# EAGLE design Intercom (EAGLE 7.5.0)

## Sheet 1 of 2
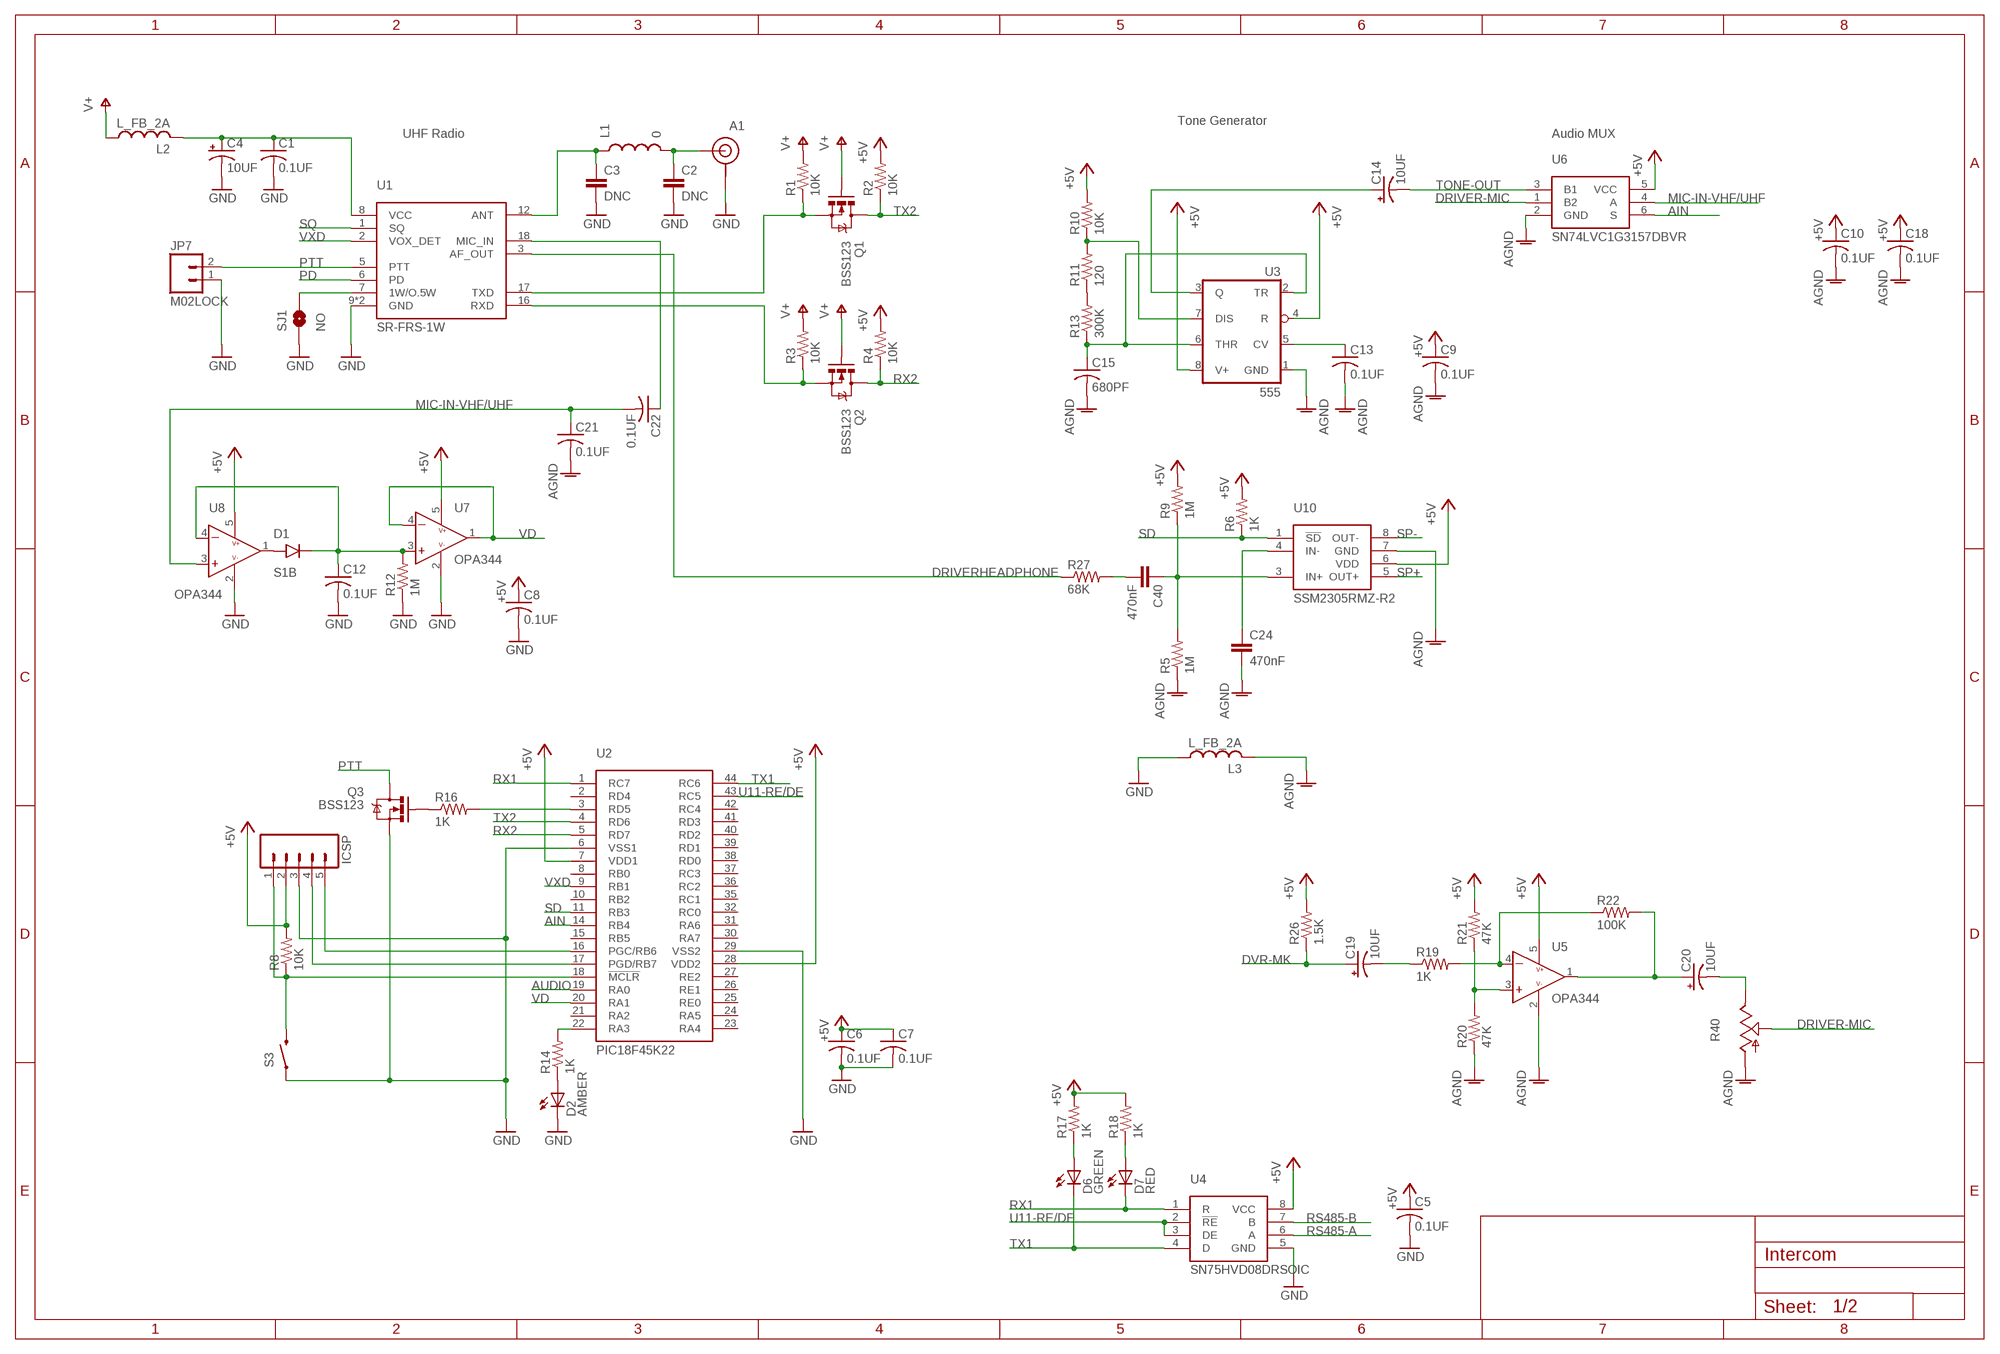
[diagram p0: schematic, sheet 1]

### Parts
A1  CONSMA003.062  [CONSMA003.062]
C1  0.1UF  CAP_0.1UF_50V_0805  [0805]
C2  DNC  CAP0805  [0805]
C3  DNC  CAP0805  [0805]
C4  10UF  CAP-POL_10UF_16V  [EIA3216-16V]
C5  0.1UF  CAP_0.1UF_50V_0805  [0805]
C6  0.1UF  CAP_0.1UF_50V_0805  [0805]
C7  0.1UF  CAP_0.1UF_50V_0805  [0805]
C8  0.1UF  CAP_0.1UF_50V_0805  [0805]
C9  0.1UF  CAP_0.1UF_50V_0805  [0805]
C10  0.1UF  CAP_0.1UF_50V_0805  [0805]
C12  0.1UF  CAP_0.1UF_50V_0805  [0805]
C13  0.1UF  CAP_0.1UF_50V_0805  [0805]
C14  10UF  CAP-POL_10UF_16V  [EIA3216-16V]
C15  680PF  CAP_680PF_50V  [0805]
C18  0.1UF  CAP_0.1UF_50V_0805  [0805]
C19  10UF  CAP-POL_10UF_16V  [EIA3216-16V]
C20  10UF  CAP-POL_10UF_16V  [EIA3216-16V]
C21  0.1UF  CAP_0.1UF_50V_0805  [0805]
C22  0.1UF  CAP_0.1UF_50V_0805  [0805]
C24  470nF  CAP0805  [0805]
C40  470nF  CAP0805  [0805]
D1  S1B  DIODE_S1B  [SMA]
D2  AMBER  LED_AMBER  [CHIP_LED0805]
D6  GREEN  LED_GREEN  [CHIP_LED0805]
D7  RED  LED_RED  [CHIP_LED0805]
ICSP  M05LOCK_LONGPADS  [1X05_LOCK_LONGPADS]
JP7  M02LOCK  [1X02_LOCK]
L1  0  INDUCTOR1007  [1007]
L2  L_FB_2A  [0805]
L3  L_FB_2A  [0805]
Q1  BSS123  MOS-N_BSS123  [SOT23]
Q2  BSS123  MOS-N_BSS123  [SOT23]
Q3  BSS123  MOS-N_BSS123  [SOT23]
R1  10K  RES_10K_1%_0805  [0805]
R2  10K  RES_10K_1%_0805  [0805]
R3  10K  RES_10K_1%_0805  [0805]
R4  10K  RES_10K_1%_0805  [0805]
R5  1M  RES_1M_1%_0805  [0805]
R6  1K  RES_1K_1%_0805  [0805]
R8  10K  RES_10K_1%_0805  [0805]
R9  1M  RES_1M_1%_0805  [0805]
R10  10K  RES_10K_1%_0805  [0805]
R11  120  RES_120_1%_0805  [0805]
R12  1M  RES_1M_1%_0805  [0805]
R13  300K  RES_300K_1%_0805  [0805]
R14  1K  RES_1K_1%_0805  [0805]
R16  1K  RES_1K_1%_0805  [0805]
R17  1K  RES_1K_1%_0805  [0805]
R18  1K  RES_1K_1%_0805  [0805]
R19  1K  RES_1K_1%_0805  [0805]
R20  47K  RES_47K_1%_0805  [0805]
R21  47K  RES_47K_1%_0805  [0805]
R22  100K  RES_100K_1%_0805  [0805]
R26  1.5K  RES_1.5K_1%_0805  [0805]
R27  68K  RES_68K_1%_0805  [0805]
R40  TRIM_US-CA6H  [CA6H]
S3  SWITCH-MOMENTARY-2SIDE_EZ  [TACTILE-PTH-SIDEEZ]
SJ1  NO  SOLDERJUMPERNO  [SJ_2S-NO]
U1  SR-FRS-1W  [SR-FRS-1W]
U2  PIC18F45K22  [TQFP-44]
U3  555  [SO-8]
U4  SN75HVD08DRSOIC  [SO-8]
U5  OPA344  [SOT23-5]
U6  SN74LVC1G3157DBVR  [SOT23-6]
U7  OPA344  [SOT23-5]
U8  OPA344  [SOT23-5]
U10  SSM2305RMZ-R2  [MSOP-8]

### Nets
+5V: C5.1(+) C6.1(+) C7.1(+) C8.1(+) C9.1(+) C10.1(+) C18.1(+) ICSP.2 R2.2 R4.2 R6.2 R8.2 R9.2 R10.2 R17.2 R18.2 R21.2 R26.2 U2.7(VDD1) U2.28(VDD2) U3.4(R) U3.8(V+) U4.8(VCC) U5.5(V+) U6.5(VCC) U7.5(V+) U8.5(V+) U10.6(VDD) ; also sheet 2
AGND: C9.2(-) C10.2(-) C13.2(-) C15.2(-) C18.2(-) C21.2(-) C24.2 L3.2 R5.1 R20.1 R40.A U3.1(GND) U5.2(V-) U6.2(GND) U10.7(GND) ; also sheet 2
AIN: U2.14(RB4) U6.6(S)
AUDIO: U2.19(RA0)
DRIVER-MIC: R40.S U6.1(B2)
DRIVERHEADPHONE: R27.1 U1.3(AF_OUT)
DVR-MK: C19.A(+) R26.1 ; also sheet 2
GND: A1.G1(GND) A1.G2(GND) A1.G3(GND) A1.G(GND) C1.2(-) C2.2 C3.2 C4.C(-) C5.2(-) C6.2(-) C7.2(-) C8.2(-) C12.2(-) D2.C ICSP.3 JP7.1 L3.1 Q3.2(S) R12.1 S3.1 SJ1.1 U1.9(GND) U1.10(GND) U2.6(VSS1) U2.29(VSS2) U4.5(GND) U7.2(V-) U8.2(V-) ; also sheet 2
MIC-IN-VHF/UHF: C21.1(+) C22.2(-) U6.4(A) U8.3(+)
N$1: C3.1 L1.1 U1.12(ANT)
N$2: A1.S(SIGNAL) C2.1 L1.2
N$3: C1.1(+) C4.A(+) L2.2 U1.8(VCC)
N$4: SJ1.2 U1.7(1W/O.5W)
N$5: D1.A U8.1(O)
N$6: C15.1(+) R13.1 U3.2(TR) U3.6(THR)
N$8: Q2.2(S) R3.1 U1.16(RXD)
N$9: Q1.2(S) R1.1 U1.17(TXD)
N$10: D2.A R14.1
N$11: C13.1(+) U3.5(CV)
N$12: R10.1 R11.2 U3.7(DIS)
N$13: C24.1 U10.4(IN-)
N$14: Q3.1(G) R16.1
N$16: R20.2 R21.1 U5.3(+)
N$17: C14.A(+) U3.3(Q)
N$19: R16.2 U2.3(RD5)
N$20: C20.C(-) R40.E
N$21: C12.1(+) D1.C R12.2 U7.3(+) U8.4(-)
N$23: R11.1 R13.2
N$28: R14.2 U2.22(RA3)
N$33: C20.A(+) R22.2 U5.1(O)
N$37: R19.2 R22.1 U5.4(-)
N$38: C19.C(-) R19.1
N$39: C40.1 R5.2 R9.1 U10.3(IN+)
N$40: ICSP.4 U2.17(PGD/RB7)
N$43: ICSP.5 U2.16(PGC/RB6)
N$45: C40.2 R27.2
N$46: ICSP.1 R8.1 S3.2 U2.18(!MCLR)
N$48: C22.1(+) U1.18(MIC_IN)
N$86: D7.A R18.1
N$87: D6.A R17.1
PD: U1.6(PD)
PTT: JP7.2 Q3.3(D) U1.5(PTT)
RS485-A: U4.6(A) ; also sheet 2
RS485-B: U4.7(B) ; also sheet 2
RX1: D7.C U2.1(RC7) U4.1(R)
RX2: Q2.3(D) R4.1 U2.5(RD7)
SD: R6.1 U2.11(RB3) U10.1(!SD)
SP+: U10.5(OUT+) ; also sheet 2
SP-: U10.8(OUT-) ; also sheet 2
SQ: U1.1(SQ)
TONE-OUT: C14.C(-) U6.3(B1)
TX1: D6.C U2.44(RC6) U4.4(D)
TX2: Q1.3(D) R2.1 U2.4(RD6)
U11-RE/DE: U2.43(RC5) U4.2(!RE) U4.3(DE)
V+: L2.1 Q1.1(G) Q2.1(G) R1.2 R3.2 ; also sheet 2
VD: U2.20(RA1) U7.1(O) U7.4(-)
VXD: U1.2(VOX_DET) U2.9(RB1)
Unconnected: U2.2(RD4) U2.8(RB0) U2.10(RB2) U2.15(RB5) U2.21(RA2) U2.23(RA4) U2.24(RA5) U2.25(RE0) U2.26(RE1) U2.27(RE2) U2.30(RA7) U2.31(RA6) U2.32(RC0) U2.35(RC1) U2.36(RC2) U2.37(RC3) U2.38(RD0) U2.39(RD1) U2.40(RD2) U2.41(RD3) U2.42(RC4)

### Notes on the sheet
- Tone Generator
- UHF Radio | Audio MUX

## Sheet 2 of 2
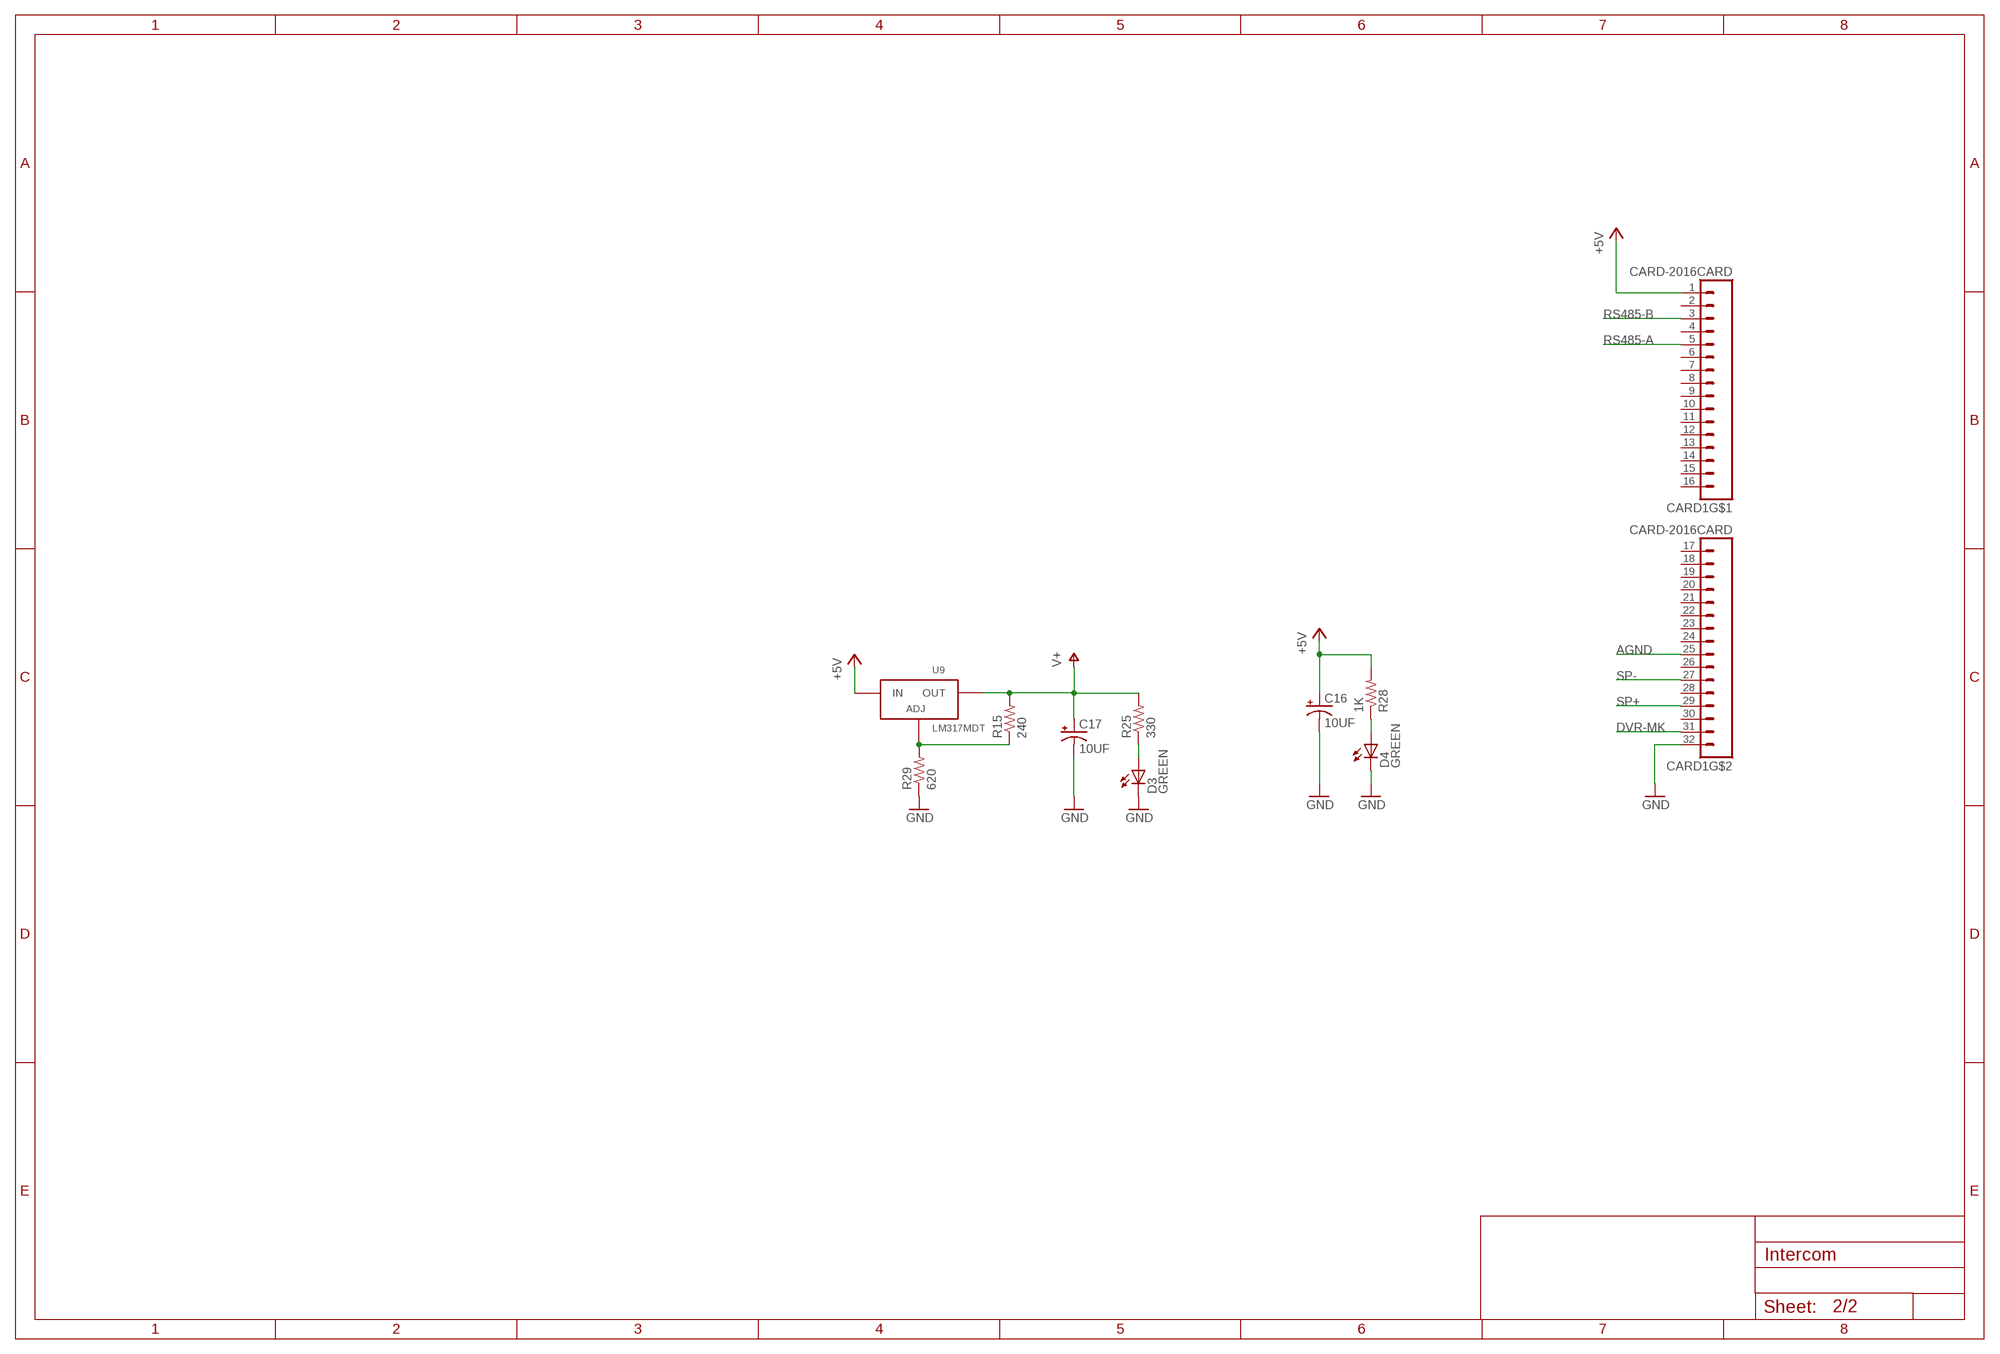
[diagram p1: schematic, sheet 2]

### Parts
C16  10UF  CAP-POL_10UF_16V  [EIA3216-16V]
C17  10UF  CAP-POL_10UF_16V  [EIA3216-16V]
CARD1  CARD-2016CARD  [CARD-2016]
D3  GREEN  LED_GREEN  [CHIP_LED0805]
D4  GREEN  LED_GREEN  [CHIP_LED0805]
R15  240  RES_240_1%_0805  [0805]
R25  330  RES_330_1%_0805  [0805]
R28  1K  RES_1K_1%_0805  [0805]
R29  620  RES_620_1%_0805  [0805]
U9  LM317MDT  [DPAK]

### Nets
+5V: C16.A(+) CARD1.1 R28.2 U9.2(IN) ; also sheet 1
AGND: CARD1.25 ; also sheet 1
DVR-MK: CARD1.31 ; also sheet 1
GND: C16.C(-) C17.C(-) CARD1.32 D3.C D4.C R29.1 ; also sheet 1
N$31: R15.1 R29.2 U9.1(ADJ)
N$54: D4.A R28.1
N$55: D3.A R25.1
RS485-A: CARD1.5 ; also sheet 1
RS485-B: CARD1.3 ; also sheet 1
SP+: CARD1.29 ; also sheet 1
SP-: CARD1.27 ; also sheet 1
V+: C17.A(+) R15.2 R25.2 U9.3(OUT) ; also sheet 1
Unconnected: CARD1.2 CARD1.4 CARD1.6 CARD1.7 CARD1.8 CARD1.9 CARD1.10 CARD1.11 CARD1.12 CARD1.13 CARD1.14 CARD1.15 CARD1.16 CARD1.17 CARD1.18 CARD1.19 CARD1.20 CARD1.21 CARD1.22 CARD1.23 CARD1.24 CARD1.26 CARD1.28 CARD1.30

## Library data of the parts
A1 = FSAE Electric:CONSMA003.062; PARTNO: CONREVSMA003.031
C1 C5-C10 C12 C13 C18 C21 C22 = FSAE Electric:CAP; PARTNO: CC0805ZRY5V9BB104
C2 C3 C24 C40 = SparkFun-Passives:CAP: Capacitor Standard 0603 ceramic capacitor, and 0.1" leaded capacitor.
C4 C14 C16 C17 C19 C20 = FSAE Electric:CAP-POL; PARTNO: T491A106M016AT
C15 = FSAE Electric:CAP; PARTNO: CC0805KRX7R9BB681
CARD1 = FSAE Electric:CARD-2016
D1 = FSAE Electric:DIODE: Diodes; PARTNO: S1B
D2 = FSAE Electric:LED; PARTNO: HSMA-C170
D3 D4 D6 = FSAE Electric:LED; PARTNO: LTST-S220GKT
D7 = FSAE Electric:LED; PARTNO: LH R974-LP-1
ICSP = SparkFun-Connectors:M05: Header 5 Standard 5-pin 0.1" header. Use with straight break away headers (SKU : PRT-00116), right angle break away headers (PRT-00553), swiss pins (PRT-00743), machine pins (PRT-00117), and female headers (PRT-00115). Molex polarized connector foot print use with SKU : PRT-08230 with associated crimp pins and housings.
JP7 = SparkFun-Connectors:M02: Standard 2-pin 0.1" header. Use with - straight break away headers ( PRT-00116) - right angle break away headers (PRT-00553) - swiss pins (PRT-00743) - machine pins (PRT-00117) - female headers (PRT-00115) Molex polarized connector foot print use with: PRT-08233 with associated crimp pins and housings. 2.54_SCREWTERM for use with PRT-10571. 3.5mm Screw Terminal footprints for PRT-08084 5mm Screw Terminal footprints for use with PRT-08433
L1 = SparkFun-Passives:INDUCTOR: Inductors Basic Inductor/Choke - 0603 and 1206. Footprints are not proven and vary greatly between part numbers. SRN6045- 33uH, 20% 1.4A SDR0403-560KL - 56uH, 10%, 500mA RMS/740mA peak
L2 L3 = FSAE Electric:L; PARTNO: FBMH2012HM121-T
Q1-Q3 = FSAE Electric:MOS-N: N-Channel Mosfets; PARTNO: BSS123,215
R1-R4 R8 R10 = FSAE Electric:RES: Resistors; PARTNO: RC0805FR-0710KL
R5 R9 R12 = FSAE Electric:RES: Resistors; PARTNO: RC0805FR-071ML
R6 R14 R16-R19 R28 = FSAE Electric:RES: Resistors; PARTNO: RC0805FR-071KL
R11 = FSAE Electric:RES: Resistors; PARTNO: RC0805FR-07120RL
R13 = FSAE Electric:RES: Resistors; PARTNO: RC0805FR-07300KL
R15 = FSAE Electric:RES: Resistors; PARTNO: RMCF0805FT240R
R20 R21 = FSAE Electric:RES: Resistors; PARTNO: RC0805FR-0747KL
R22 = FSAE Electric:RES: Resistors; PARTNO: RC0805FR-07100KL
R25 = FSAE Electric:RES: Resistors; PARTNO: RC0805FR-07330RL
R26 = FSAE Electric:RES: Resistors; PARTNO: RC0805FR-071K5L
R27 = FSAE Electric:RES: Resistors; PARTNO: RC0805FR-0768KL
R29 = FSAE Electric:RES: Resistors; PARTNO: RC0805FR-07620RL
R40 = pot:TRIM_US-: POTENTIOMETER
S3 = SparkFun-Electromechanical:SWITCH-MOMENTARY-2: Various NO switches- pushbuttons, reed, etc
SJ1 = SparkFun-Passives:SOLDERJUMPER: Solder Jumper Standard SMD solder jumper. Used to automate production. Two varients : Normally Open and Normally Closed are the same, but have different paste layers. NC will have a large amount of paste and should jumper during reflow.
U1 = FSAE Eletric:SR-FRS-1W
U2 = FSAE Electric:PIC18F45K22: Microprocessor used in many places on the car View on DigiKey <http://www.digikey.com/product-detail/en/PIC18F45K22T-I%2FPT/PIC18F45K22T-I%2FPTCT-ND/5169582>; PARTNO: PIC18F45K22T-I/PT
U3 = FSAE Electric:555; PARTNO: NE555PSR
U4 = FSAE Electric:SN75HVD08DR: RS485 Transceiver View on DigiKey <http://www.digikey.com/product-detail/en/SN75HVD08DR/296-37893-1-ND/4899996>; PARTNO: SN75HVD08DR
U5 U7 U8 = FSAE Electric:OPA344; PARTNO: OPA344NA/3K
U6 = FSAE Electric:SN74LVC1G3157DBVR; PARTNO: SN74LVC1G3157DBVR
U9 = FSAE Electric:LM317MDT: IC REG LDO ADJ 0.5A 1.2 V ~ 37 V; PARTNO: LM317MDT-TR
U10 = FSAE Electric:SSM2305RMZ-R2: IC AMP AUDIO 2.8W MONO D

## Net classes
1 VCC: width 0.254 mm, clearance 0.254 mm

## Board
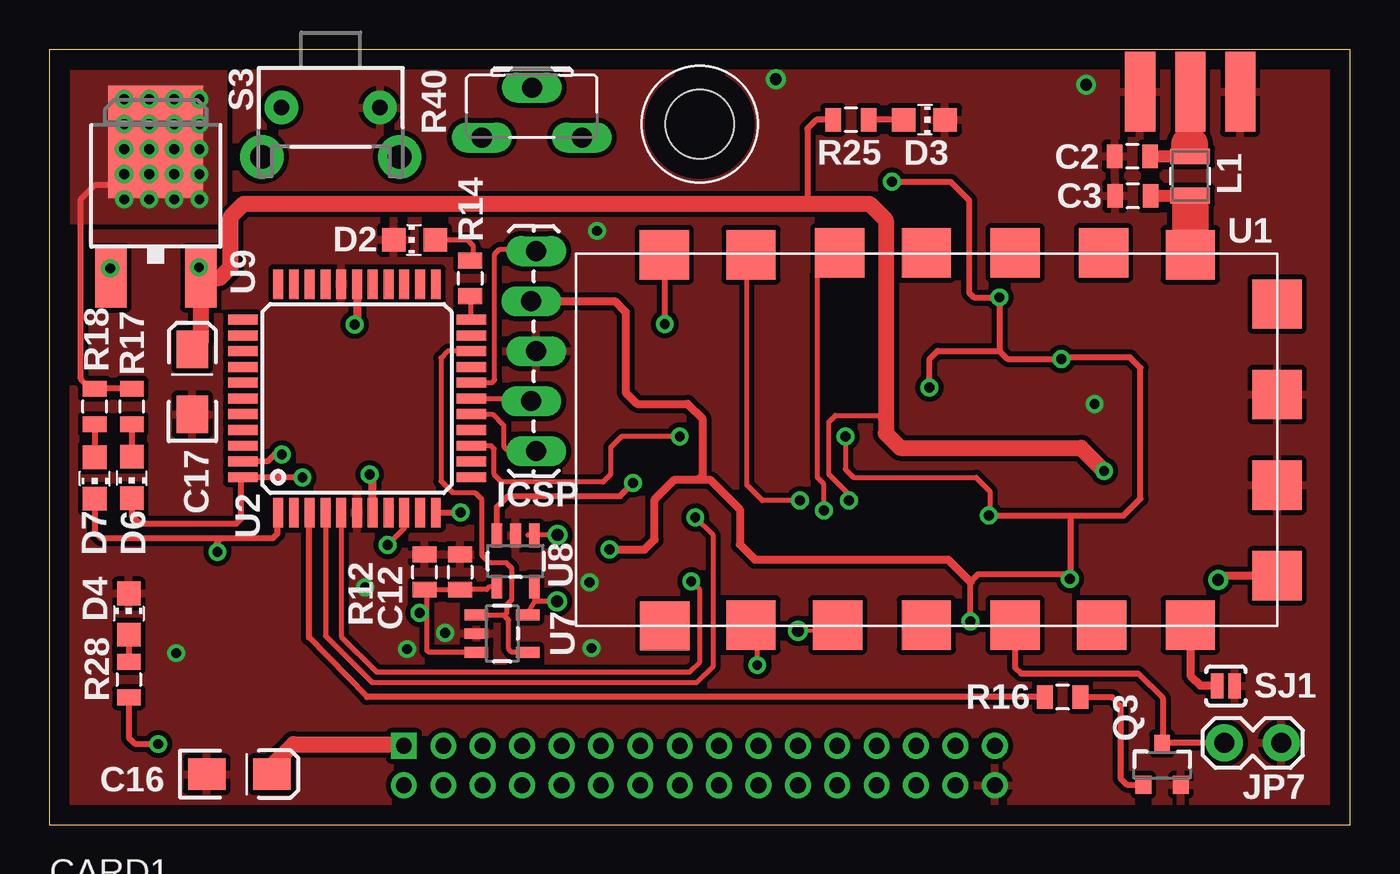
[diagram p2: board, top side]
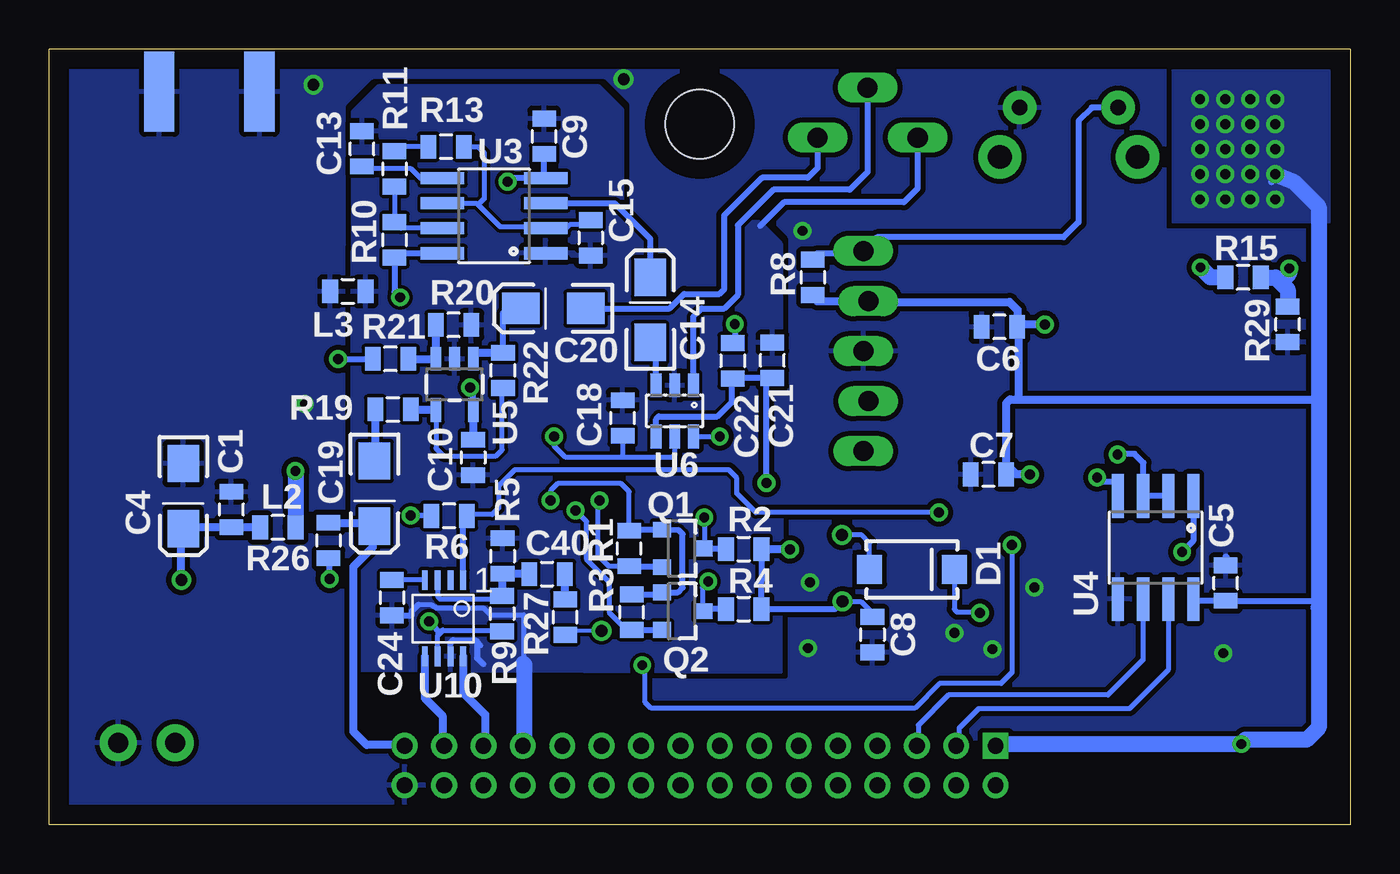
[diagram p3: board, bottom side, seen from below]

Size 66.04 x 39.37 mm. Coordinates in mm from the lower left corner, seen from the top.
Copper layers (1*16): Top 0.035mm / dielectric 1.5mm / Bottom 0.035mm
Design rules "default *": minimum track width 7mil, minimum drill 12mil, track to track 7mil, track to pad 7mil, pad to pad 7mil, via to via 7mil, smd to smd 7mil, copper to edge 40mil, drill to drill 8mil, minimum pad ring 10mil, minimum via ring 8mil, stop-mask expansion 4mil, vias tented up to drill 0mil, thermal gap 10mil

### Footprints (pad centres in the part's own frame; a part is rotated, then mirrored left to right if it is on the bottom)
CONSMA003.062 = smd 4.064 x 1.524: G 0,2.54; G1 0,-2.54; S 0,0 | smd 4.064 x 1.524 bottom: G2 0,2.54; G3 0,-2.54
0805 = smd 0.8 x 1.2: 1 -0.9,0; 2 0.9,0
EIA3216-16V = smd 1.9 x 1.6: A 1.65,0; C -1.65,0
CARD-2016 = drill 0.8 square: 1 18,4 | drill 0.8: 2 18,2; 3 20,4; 4 20,2; 5 22,4; 6 22,2; 7 24,4; 8 24,2; 9 26,4; 10 26,2; 11 28,4; 12 28,2; 13 30,4; 14 30,2; 15 32,4; 16 32,2; 17 34,4; 18 34,2; 19 36,4; 20 36,2; 21 38,4; 22 38,2; 23 40,4; 24 40,2; 25 42,4; 26 42,2; 27 44,4; 28 44,2; 29 46,4; 30 46,2; 31 48,4; 32 48,2 | hole 3.5: 33.02,35.56
SMA = smd 1.27 x 1.47: A -2.15,0; C 2.15,0
CHIP_LED0805 = smd 1.2 x 1.2: A 0,-1.05; C 0,1.05
1X05_LOCK_LONGPADS = drill 1.016 long: 1 0,0; 2 2.54,-0.254; 3 5.08,0; 4 7.62,-0.254; 5 10.16,0
1X02_LOCK = drill 1.016 pad 1.88: 1 -0.178,0; 2 2.718,0
1007 = smd 2 x 0.8: 1 0,1; 2 0,-1
SOT23 = smd 0.8 x 0.9: 1 -0.95,-1; 2 0.95,-1; 3 0,1.1
CA6H = drill 1.016 long: A -2.54,0; E 2.54,0; S 0,2.54
TACTILE-PTH-SIDEEZ = drill 0.8 pad 1.7: 1 -2.5,0; 2 2.5,0 | drill 1.2 pad 2.2: ANCHOR1 -3.5,2.5; ANCHOR2 3.5,2.5
SJ_2S-NO = smd 0.635 x 1.27: 1 -0.45,0; 2 0.45,0
SR-FRS-1W = smd 2.5 x 2.5: 1 0,31.1; 2 0.04,26.72; 3 0.04,22.32; 4 0.04,17.82; 5 0.04,13.32; 6 0.04,8.92; 7 0.04,4.42; 8 2.54,0.02; 9 7.14,0.02; 10 11.74,0.02; 11 16.34,0.02; 12 18.84,4.42; 13 18.94,8.82; 14 18.94,13.32; 15 18.94,17.82; 16 18.94,22.22; 17 18.84,26.72; 18 18.84,31.12
TQFP-44 = smd 1.5 x 0.5: 1 -5.8,4; 2 -5.8,3.2; 3 -5.8,2.4; 4 -5.8,1.6; 5 -5.8,0.8; 6 -5.8,0; 7 -5.8,-0.8; 8 -5.8,-1.6; 9 -5.8,-2.4; 10 -5.8,-3.2; 11 -5.8,-4; 23 5.8,-4; 24 5.8,-3.2; 25 5.8,-2.4; 26 5.8,-1.6; 27 5.8,-0.8; 28 5.8,0; 29 5.8,0.8; 30 5.8,1.6; 31 5.8,2.4; 32 5.8,3.2; 33 5.8,4 | smd 0.5 x 1.5: 12 -4,-5.8; 13 -3.2,-5.8; 14 -2.4,-5.8; 15 -1.6,-5.8; 16 -0.8,-5.8; 17 0,-5.8; 18 0.8,-5.8; 19 1.6,-5.8; 20 2.4,-5.8; 21 3.2,-5.8; 22 4,-5.8; 34 4,5.8; 35 3.2,5.8; 36 2.4,5.8; 37 1.6,5.8; 38 0.8,5.8; 39 0,5.8; 40 -0.8,5.8; 41 -1.6,5.8; 42 -2.4,5.8; 43 -3.2,5.8; 44 -4,5.8
SO-8 = smd 0.61 x 2.21: 1 -1.905,-2.616; 2 -0.635,-2.616; 3 0.635,-2.616; 4 1.905,-2.616; 5 1.905,2.616; 6 0.635,2.616; 7 -0.635,2.616; 8 -1.905,2.616
SOT23-5 = smd 0.55 x 1.2: 1 -0.95,-1.3; 2 0,-1.3; 3 0.95,-1.3; 4 0.95,1.3; 5 -0.95,1.3
SOT23-6 = smd 0.55 x 1.2: 1 -0.95,-1.3; 2 0,-1.3; 3 0.95,-1.3; 4 0.95,1.3; 5 0,1.3; 6 -0.95,1.3
DPAK = smd 1.6 x 3: 1 -2.28,-4.04; 3 2.28,-4.04 | smd 4.826 x 5.715: 2 0,2.858
MSOP-8 = smd 0.3 x 1: 1 -0.975,-1.95; 2 -0.325,-1.95; 3 0.325,-1.95; 4 0.975,-1.95; 5 0.975,1.925; 6 0.325,1.925; 7 -0.325,1.925; 8 -0.975,1.925

### Placement (x,y rotation side)
A1  57.91,37.21 90 top
C1  56.79,16 90 bottom
C2  54.98,33.93 180 top
C3  55,31.93 180 top
C4  59.23,16.69 270 bottom
C5  6.32,12.27 90 bottom
C6  17.81,25.27 180 bottom
C7  18.36,17.78 180 bottom
C8  24.26,9.65 270 bottom
C9  40.92,34.95 90 bottom
C10  44.53,18.64 270 bottom
C12  19.05,12.83 90 top
C13  50.16,34.32 90 bottom
C14  35.53,26.14 90 bottom
C15  38.56,29.79 270 bottom
C16  9.65,2.57 0 top
C17  7.26,22.48 90 top
C18  36.93,20.65 90 bottom
C19  49.53,16.81 270 bottom
C20  40.46,26.21 180 bottom
C21  29.34,23.57 90 bottom
C22  31.34,23.55 270 bottom
C24  48.64,11.53 270 bottom
C40  40.77,12.73 0 bottom
CARD1  0,0 0 top
D1  22.25,12.95 0 bottom
D2  18.54,29.69 90 top
D3  44.42,35.79 270 top
D4  4.04,10.69 0 top
D6  4.19,17.63 180 top
D7  2.31,17.6 180 top
ICSP  24.71,29.12 270 top
JP7  62.37,4.15 180 top
L1  57.91,32.93 180 top
L2  54.43,15.09 180 bottom
L3  50.88,27.08 0 bottom
Q1  33.93,14.02 270 bottom
Q2  33.93,10.85 270 bottom
Q3  56.49,3.02 0 top
R1  36.6,14.02 90 bottom
R2  30.78,14 0 bottom
R3  36.47,10.79 90 bottom
R4  30.78,10.95 0 bottom
R5  43.03,13.64 270 bottom
R6  45.75,15.67 180 bottom
R8  27.28,27.79 270 bottom
R9  43.05,10.72 270 bottom
R10  48.51,29.69 270 bottom
R11  48.51,33.3 270 bottom
R12  20.85,12.83 270 top
R13  45.9,34.42 180 bottom
R14  21.36,27.74 270 top
R15  5.44,27.79 180 bottom
R16  51.44,6.48 180 top
R17  4.19,21.23 90 top
R18  2.31,21.23 90 top
R19  48.59,21.08 0 bottom
R20  45.52,25.37 180 bottom
R21  48.72,23.65 180 bottom
R22  43,23.06 90 bottom
R25  40.69,35.79 180 top
R26  51.87,14.43 270 bottom
R27  39.85,10.54 90 bottom
R28  4.04,7.37 270 top
R29  3.17,25.4 90 bottom
R40  24.5,34.89 0 top
S3  14.29,36.41 180 top
SJ1  59.73,7.04 180 top
U1  62.34,10.1 90 top
U2  15.62,21.64 90 top
U3  43.46,30.91 90 bottom
U4  9.88,14.07 180 bottom
U5  45.47,22.35 180 bottom
U6  34.29,21.01 180 bottom
U7  22.99,9.7 270 top
U8  23.67,13.39 180 top
U9  5.41,31.8 0 top
U10  46,10.46 180 bottom

### Tracks (layer width: path | path; a pad name or v marks a point on that pad's centre or on a via)
+5V  (via drill 0.5, 0.6)
  Top 0.254: U8.5 24.62,11.33 | 24.62,11.33 24.24,10.7 U7.5 | v25.78,11.33 24.62,11.33 | v40.41,19.71 40.41,18.03 40.82,17.63 47.04,17.63 47.75,16.92 47.75,15.75 v47.7,15.7 | U9.2 5.41,33.48 5.31,33.38 | 5.08,34.88 5.08,33.7
  Top 0.305: 48.23,24.05 v48.23,26.77 46.94,26.77 46.69,27.03 46.69,31.7 45.74,32.64 v42.77,32.64 | 48.23,24.05 48.64,23.65 v51.38,23.65 51.46,23.72 54.86,23.72 55.4,23.19 55.4,16.56 54.53,15.7 51.87,15.7 | v44.68,22.2 44.68,23.65 45.09,24.05 48.23,24.05 | R28.2 4.04,4.42 4.34,4.12 5.51,4.12 v5.54,4.09 | v46.76,10.31 46.76,12.32 47.17,12.72 51.61,12.72 v51.82,12.47 51.84,12.55 51.84,15.67 51.87,15.7 | v47.7,15.7 51.87,15.7 | R17.2 R18.2 2.1,22.13 1.6,22.63 1.6,31.75 2.34,32.49 3.86,32.49 3.99,32.61
  Top 0.406: U2.28 15.62,25.53 v15.49,25.4 | U2.7 16.42,17.61 v16.26,17.78 | v28.45,13.97 30.23,13.97 30.73,14.48 30.73,16.51 31.75,17.53 32.97,17.53 | 32.97,17.53 33.53,17.53 35.05,16 35.05,14.22 35.81,13.46 45.62,13.46 46.76,12.32 | ICSP.2 28.71,26.58 29.26,26.04 29.26,21.95 29.84,21.36 32.41,21.36 33.15,20.62 33.15,17.7 32.97,17.53
  Top 0.813: 5.31,33.38 4.8,33.38 v3.81,33.02 | C16.A 11.3,3 12.39,4.09 17.91,4.09 CARD1.1
  Bottom 0.254: U3.4 40.79,32.77 | U10.6 46.32,9.61 46.05,9.86 42.99,9.86 R9.2 | C8.1 24.26,10.74 24.82,11.3 25.76,11.3 v25.78,11.33 | U6.5 34.29,18.77 34.42,18.64 36.93,18.64 | 36.93,18.64 39.83,18.64 40.41,19.23 v40.41,19.71 | C18.1 36.93,18.64 | 16.84,25.21 C6.1
  Bottom 0.305: 40.92,32.92 C9.1 | U3.8 48.39,29.01 48.51,28.88 R10.2 48.51,27.05 v48.23,26.77 | v51.38,23.65 R21.2 | U5.5 44.52,21.89 44.68,22.05 v44.68,22.2 | 40.92,32.82 42.6,32.82 v42.77,32.64 | U4.8 7.89,11.37 C5.1 1.95,11.37 1.6,11.02 | R6.2 v47.7,15.7 | v51.82,12.47 51.82,13.48 R26.2 | 46.05,9.86 46.08,9.86 46.28,9.65 46.28,9.78 v46.76,10.31 | v3.81,33.02 4.01,32.64 3.99,32.61 | R2.2 29.86,13.74 R4.2 26.16,10.95 v25.78,11.33
  Bottom 0.406: U3.4 40.92,32.82 40.92,32.92 | U5.5 44.52,19.55 C10.1 | C7.1 17.46,18.29 | 17.46,18.29 17.46,21.4 17.27,21.59 16.76,21.59 | 16.76,21.59 1.6,21.59 | v15.49,25.4 16.78,25.4 C6.1 16.89,25.29 16.89,26.14 17.3,26.54 24.46,26.54 ICSP.2 27.05,26.58 27.28,26.81 R8.2 | 16.84,25.21 16.84,21.67 16.76,21.59 | v16.26,17.78 16.96,17.78 17.46,18.29 | R2.2 28.47,13.99 v28.45,13.97
  Bottom 0.813: v3.81,33.02 2.87,32.64 1.6,31.37 1.6,21.59 1.6,11.02 1.6,4.93 2.21,4.32 5.31,4.32 v5.54,4.09 18,4.09 CARD1.1
  other vias: 3.81,36.83 5.08,36.83 6.35,36.83 7.62,36.83 3.81,35.56 5.08,35.56 6.35,35.56 7.62,35.56 7.62,34.29 6.35,34.29 5.08,34.29 3.81,34.29 5.08,33.02 6.35,33.02 7.62,33.02 7.62,31.75 6.35,31.75 5.08,31.75 3.81,31.75
  pour Top (no thermals): 1.07,38.35 8.92,38.35 8.92,30.58 1.07,30.58
  pour Bottom: 1.04,38.3 8.97,38.28 8.97,30.63 1.04,30.66
AGND
  Bottom 0.254: U10.7 45.67,9.14 45.52,9.37 44.45,9.37 44.35,9.37 44.15,9.09 | 47.3,11.18 46.63,11.18 46.56,11.1 46.51,11.1 46.43,11.02 46.41,11.02 46.38,11 43.99,11 43.64,10.64 41.99,10.64 41.96,10.67 41.96,8.2 41.99,8.18
  Bottom 0.305: R40.A 21.96,32.3 22.66,31.6 28.75,31.6 29.95,30.4 | 45.67,9.14 45.67,9.24 45.54,9.37 45.52,9.37 | 44.45,9.37 44.32,9.25 44.32,8.46 44.02,8.15 | C24.2 47.64,10.63 47.62,10.64 47.62,10.85 47.3,11.18
  Bottom 0.406: CARD1.25 41.92,4 41.92,4.12
  Bottom 0.813: 41.92,4.05 41.92,4.12 41.92,8.12 41.99,8.18
  pour Bottom: 28.88,14.35 28.91,29.46 30,30.56 36.04,30.56 36.96,31.47 36.96,36.27 38.15,37.47 49.33,37.47 50.62,36.17 50.67,8.08 50.67,7.87 38.89,7.82 28.93,7.77 28.93,10.11
AIN  (via drill 0.5)
  Top 0.254: v32,19.71 29.06,19.71 28.5,19.15 28.5,17.78 28.12,17.4 22.96,17.4 22.58,17.78 22.58,19.07 22.43,19.23 21.43,19.23 U2.14
  Bottom 0.254: U6.6 v32.01,19.71 v32,19.71
DRIVER-MIC
  Bottom 0.305: R40.S 24.5,33.13 25.4,32.23 29.29,32.23 31.09,30.43 31.09,26.9 31.77,26.21 32.92,26.21 33.34,25.79 U6.1
DRIVERHEADPHONE  (via drill 0.61)
  Top 0.203: v38,9.83 39.9,9.83 U1.3
  Bottom 0.203: v38,9.83 39.27,9.83 R27.1
DVR-MK
  Bottom 0.406: 48,4.05 49.92,4.05 50.6,4.72 50.6,13.11 49.61,14.1 49.61,15.09 C19.A 49.69,15.33 R26.1 | 47.92,4.05 48,4.05 | 48,4.05 CARD1.31
GND  (via drill 0.5, 0.6)
  Bottom 0.203: C5.2 6.25,13.64 6.38,13.64
  other vias: 36.88,37.85 52.63,37.57 6.45,8.71 27.53,8.97 20.09,9.73 27.43,12.29 16.03,12.04 18.16,8.92 27.81,30.15 53.06,21.36
  pour Bottom (isolate 0.254, rank 6): -0.37,-0.56 -0.22,39.26 67.63,40.35 68.01,-0.66
  pour Top (isolate 0.254, rank 5): -0.14,-0.03 0.14,40.01 66.54,39.8 66.26,-0.03
MIC-IN-VHF/UHF  (via drill 0.5)
  Top 0.305: U8.3 22.72,16.12 23.29,16.69 28.98,16.69 v29.64,17.35
  Bottom 0.305: U6.4 35.24,20.59 35.1,20.73 32.13,20.73 31.39,21.46 31.39,22.59 C22.2 31.32,22.67 C21.1 29.64,22.37 v29.64,17.35
N$1
  Top 0.61: C3.1 L1.1 57.99,31.93 57.99,31.42 57.92,31.42 57.92,31.34
  Top 1.85: U1.12 57.92,31.34 57.91,31.34
N$2
  Top 0.406: A1.S 57.91,34.37
  Top 0.61: C2.1 L1.2 57.91,34.37 57.91,34.52 57.89,34.52
  Top 1.85: 57.87,34.52 57.89,34.52
N$3  (via drill 0.6)
  Top 0.406: U1.8 59.55,12.64 v59.33,12.42
  Bottom 0.406: v59.33,12.42 59.33,14.94 C4.A 59.17,15.1 C1.1 56.78,15.09 L2.2
N$4
  Top 0.406: U1.7 57.92,7.56 58.42,7.06 59.25,7.06 SJ1.2
N$5  (via drill 0.6)
  Top 0.254: v25.81,14.71 24.29,14.71 U8.1
  Bottom 0.254: D1.A 24.4,14.32 24.79,14.71 v25.81,14.71
N$6
  Bottom 0.254: C15.1 38.77,30.48 39.6,30.48 39.8,30.28 U3.2 40.95,30.18 41.53,30.18 41.71,30.35 43.16,30.35 44.27,31.47 | U3.6 44.35,31.55 44.27,31.47 | R13.1 44.27,34.42 43.97,34.11 43.97,31.77 44.27,31.47
N$8  (via drill 0.5)
  Top 0.254: v39.32,15.95 39.32,17.3 38.99,17.63 38.99,27.9 U1.16
  Bottom 0.254: R3.1 36.74,9.89 37.59,10.74 37.59,12.29 38.76,13.46 38.76,15.39 v39.32,15.95
  Bottom 0.305: R3.1 Q2.2
N$9  (via drill 0.5)
  Top 0.254: v38.1,16.46 36.2,16.46 35.41,17.25 35.41,28.72 U1.17
  Bottom 0.254: R1.1 37.63,13.12 38.18,13.66 38.18,16.38 v38.1,16.46
  Bottom 0.305: R1.1 34.98,13.12 Q1.2
N$10
  Top 0.254: D2.A 21.21,29.69 21.51,29.39 21.51,28.79 R14.1
N$11
  Bottom 0.254: U3.5 47.19,32.82 47.68,33.3 50.05,33.3 C13.1
N$12
  Bottom 0.254: R11.2 R10.1 48.2,30.28 U3.7
N$13
  Bottom 0.254: U10.4 48.62,12.41 C24.1
N$14
  Top 0.305: R16.1 53.95,6.48 54.38,6.04 54.38,2.36 54.71,2.03 55.53,2.03 Q3.1
N$16
  Bottom 0.406: R20.2 U5.3 R21.1
N$17
  Bottom 0.305: U3.3 37.34,31.55 35.53,29.74 C14.A
N$19
  Top 0.305: R16.2 16.13,6.48 13.18,9.5 13.18,15.78 U2.3
N$20
  Bottom 0.305: R40.E 27.04,33.34 27.53,32.84 29.87,32.84 31.77,30.94 31.77,27.2 32.03,26.95 33.81,26.95 34.54,26.21 C20.C
N$21  (via drill 0.5)
  Top 0.254: U7.3 19.26,8.75 19.18,8.84 19.18,10.74 | 19.18,10.74 19.18,11.8 C12.1 R12.2 20.86,11.94 22.2,11.94 22.32,12.06 U8.4 | v18.8,10.74 19.18,10.74
  Bottom 0.254: D1.C 20.1,10.93 19.96,10.79 19,10.79 v18.8,10.74
N$23
  Bottom 0.254: R13.2 48.3,34.42 R11.1
N$28
  Top 0.254: U2.22 21.42,26.78 R14.2
N$31  (via drill 0.5)
  Top 0.813: U9.1 3.13,28.21 v3.1,28.25
  Bottom 0.813: R15.1 3.79,27.79 3.54,27.55 | 3.54,27.55 3.17,27.18 R29.2 | v3.1,28.25 3.1,27.99 3.54,27.55
N$33
  Bottom 0.305: C20.A 42.77,26.21 43.03,25.96 43.03,23.99 R22.2
  Bottom 0.406: U5.1 44.52,23.91 44.45,23.98 43.02,23.98 R22.2
N$37
  Bottom 0.254: U5.4 46.42,19.11 46.02,18.72 43.36,18.72 43.05,19.02 43.05,22.11 R22.1
  Bottom 0.406: R19.2 46.45,21.08 U5.4
N$38
  Bottom 0.406: R19.1 49.49,18.5 C19.C
N$39
  Bottom 0.254: U10.3 46.32,11.58 46.2,11.46 43.09,11.46 R9.1
  Bottom 0.406: C40.1 43.03,12.72 R5.2 43.05,12.74 R9.1
N$40
  Top 0.254: U2.17 24.32,21.64 ICSP.4
N$43
  Top 0.254: U2.16 22.49,20.84 23.06,20.27 23.06,19.2 23.22,19.05 24.62,19.05 ICSP.5
N$45
  Bottom 0.406: R27.2 39.87,11.44 C40.2
N$46
  Top 0.254: U2.18 22.47,22.44 22.61,22.58 22.61,28.96 22.86,29.21 24.62,29.21 ICSP.1 24.83,29.01
  Bottom 0.305: R8.1 27.28,28.78 27.05,29.01 24.83,29.01 ICSP.1 24.02,29.82 14.55,29.82 13.79,30.58 13.79,35.74 13.12,36.41 S3.2
N$48  (via drill 0.5)
  Top 0.305: U1.18 31.22,25.6 v31.24,25.43
  Bottom 0.305: v31.24,25.43 31.24,24.55 C22.1
N$54
  Top 0.305: D4.A R28.1
N$55
  Top 0.305: D3.A R25.1
N$86
  Top 0.305: R18.1 D7.A
N$87
  Top 0.305: R17.1 D6.A
PTT
  Top 0.305: U1.5 49.02,7.97 49.33,7.67 55.27,7.67 56.52,6.43 56.52,4.15 Q3.3 56.52,4.15 JP7.2
RS485-A
  Bottom 0.254: U4.6 10.52,8.36 12.29,6.58 20.4,6.58 21.92,5.05 21.92,4.05 21.97,4.1
  Bottom 0.406: 21.97,4.1 22,4.1 CARD1.5
RS485-B
  Bottom 0.254: U4.7 9.25,7.85 11.2,5.89 18.87,5.89 19.86,4.9 19.86,4.11 19.92,4.05
  Bottom 0.406: CARD1.3 19.92,4 19.92,4.05
RX1  (via drill 0.5)
  Top 0.305: D7.C 2.31,14.86 2.62,14.55 8.74,14.55 | 8.74,14.55 11.35,14.55 11.58,14.78 11.58,15.8 U2.1 | v8.53,13.84 8.53,14.35 8.74,14.55
  Bottom 0.305: U4.1 7.98,14.4 v8.53,13.84
RX2  (via drill 0.5)
  Top 0.254: U2.5 14.82,9.54 16.61,7.75 32.51,7.75 33.02,8.26 33.02,11.91 v32.59,12.34
  Bottom 0.254: v32.59,12.34 32.89,12.04 32.89,10.9 Q2.3
  Bottom 0.305: R4.1 32.73,10.95 Q2.3
SD  (via drill 0.5)
  Top 0.305: U2.11 v20.87,15.84 v20.88,15.85
  Bottom 0.254: v20.88,15.85 30.18,15.85 31.14,16.82 31.14,17.6 31.55,18.01 42.42,18.01 43.23,17.2 43.23,16.08 43.56,15.75 44.97,15.75 R6.1
  Bottom 0.305: U10.1 45.02,15.7 R6.1 44.87,15.85
SP+
  Bottom 0.406: U10.5 46.97,6.44 46.08,5.54 46.08,4.2 45.96,4.08 | 45.96,4.08 45.92,4.05 | CARD1.29 45.96,4 45.96,4.08
SP-
  Bottom 0.406: U10.8 45.02,6.7 43.92,5.59 43.92,4.06 | 43.92,4.06 43.92,4.05 | 43.92,4.06 44,4.06 CARD1.27
TONE-OUT
  Bottom 0.305: C14.C 35.64,24.39 35.64,24.11 35.26,23.72 35.26,22.32 U6.3
TX1  (via drill 0.5)
  Top 0.305: D6.C 4.19,15.7 4.6,15.29 9.5,15.29 9.75,15.54 9.75,17.57 U2.44 9.83,17.63 v12.85,17.63
  Bottom 0.305: U4.4 11.79,17.22 11.96,17.4 12.62,17.4 v12.85,17.63
TX2  (via drill 0.5)
  Top 0.254: U2.4 14.02,9.58 16.38,7.21 32.87,7.21 33.71,8.05 33.71,14.68 v32.79,15.6
  Bottom 0.254: v32.79,15.6 32.79,14.06 Q1.3
  Bottom 0.305: R2.1 32.81,13.99 Q1.3
U11-RE/DE  (via drill 0.5)
  Top 0.305: v11.81,18.8 11.43,18.8 11.07,18.44 U2.43
  Bottom 0.254: U4.2 U4.3
  Bottom 0.305: U4.2 10.39,16.69 10.49,16.79 10.49,18.36 10.95,18.82 11.79,18.82 v11.81,18.8
V+  (via drill 0.5)
  Top 0.254: v40.59,16.46 40.59,16.76 39.57,17.78 39.57,20.45 39.9,20.78 42.34,20.78 42.47,20.65
  Top 0.305: R25.2 38.94,35.79 38.48,35.33 38.48,31.62 38.38,31.52
  Top 0.813: U9.3 8.66,27.76 9.22,28.32 9.22,30.86 9.88,31.52 38.38,31.52 41.63,31.52 42.47,30.68 42.47,20.65 42.47,19.86 43.2,19.13 52.38,19.13 v53.54,17.96 | U9.3 7.69,24.55 C17.A | v7.59,28.3 7.59,27.86 U9.3
  Bottom 0.254: R1.2 36.6,16.92 37.01,17.32 40.23,17.32 40.59,16.97 v40.59,16.46
  Bottom 0.305: R3.2 35.03,11.7 Q2.1 34.13,11.8 33.88,12.04 33.88,14.76 34.09,14.96 34.9,14.94 Q1.1 36.55,14.97 R1.2
  Bottom 0.813: v53.54,17.96 53.54,15.1 L2.1 | R15.2 7.09,27.79 v7.59,28.3
VD
  Top 0.254: U7.4 23.48,8.75 23.32,8.91 23.32,10.39 23.09,10.62 | 23.09,10.62 21.72,10.62 U7.1 | U2.20 20.23,24.04 19.89,23.7 19.89,17.45 20.47,16.87 21.61,16.87 21.95,16.54 21.95,13.69 22.33,13.31 23.19,13.31 23.47,13.03 23.47,11.4 23.22,11.15 23.22,10.74 23.09,10.62
  Top 0.305: U7.1 21.63,10.65 21.54,10.74
VXD  (via drill 0.5)
  Top 0.254: U2.9 18.02,15.05 v17.17,14.2 | v35.94,8.1 35.94,9.82 U1.2
  Bottom 0.254: v17.17,14.2 17.17,7.72 17.73,7.16 20.85,7.16 22.1,5.92 35.48,5.92 35.79,6.22 35.79,7.95 v35.94,8.1